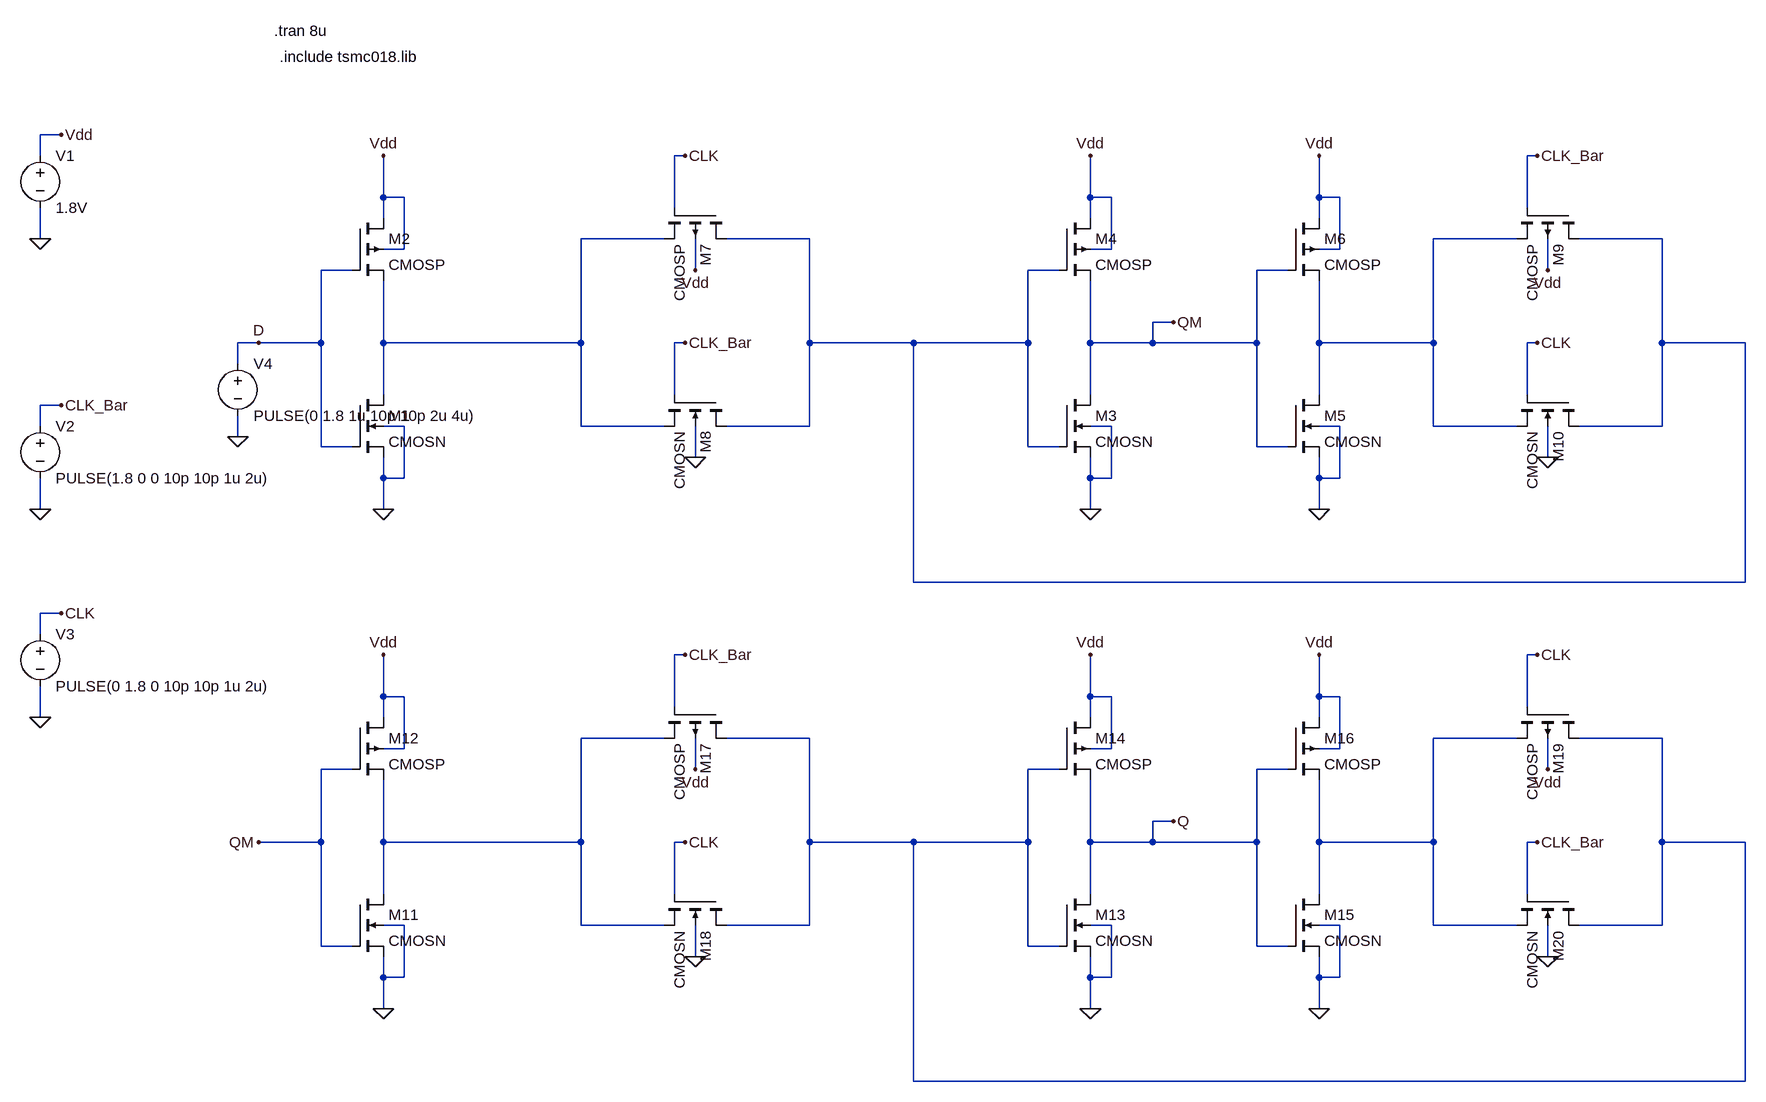
[diagram p0: schematic MasterSlaveD_FF.asc]
MasterSlaveD_FF.asc, the LTspice schematic file:
Version 4
SHEET 1 2900 1140
WIRE -320 -320 -352 -320
WIRE -352 -288 -352 -320
WIRE 640 -288 624 -288
WIRE 1952 -288 1936 -288
WIRE 176 -224 176 -288
WIRE 208 -224 176 -224
WIRE 1264 -224 1264 -288
WIRE 1296 -224 1264 -224
WIRE 1616 -224 1616 -288
WIRE 1648 -224 1616 -224
WIRE 624 -208 624 -288
WIRE 1936 -208 1936 -288
WIRE 176 -192 176 -224
WIRE 1264 -192 1264 -224
WIRE 1616 -192 1616 -224
WIRE -352 -160 -352 -208
WIRE 608 -160 480 -160
WIRE 832 -160 704 -160
WIRE 1920 -160 1792 -160
WIRE 2144 -160 2016 -160
WIRE 208 -144 208 -224
WIRE 208 -144 176 -144
WIRE 1296 -144 1296 -224
WIRE 1296 -144 1264 -144
WIRE 1648 -144 1648 -224
WIRE 1648 -144 1616 -144
WIRE 128 -112 80 -112
WIRE 656 -112 656 -160
WIRE 1216 -112 1168 -112
WIRE 1568 -112 1520 -112
WIRE 1968 -112 1968 -160
WIRE 1392 -32 1360 -32
WIRE -16 0 -48 0
WIRE 80 0 80 -112
WIRE 80 0 -16 0
WIRE 176 0 176 -96
WIRE 480 0 480 -160
WIRE 480 0 176 0
WIRE 640 0 624 0
WIRE 832 0 832 -160
WIRE 992 0 832 0
WIRE 1168 0 1168 -112
WIRE 1168 0 992 0
WIRE 1264 0 1264 -96
WIRE 1360 0 1360 -32
WIRE 1360 0 1264 0
WIRE 1520 0 1520 -112
WIRE 1520 0 1360 0
WIRE 1616 0 1616 -96
WIRE 1792 0 1792 -160
WIRE 1792 0 1616 0
WIRE 1952 0 1936 0
WIRE 2144 0 2144 -160
WIRE 2272 0 2144 0
WIRE -48 32 -48 0
WIRE 176 80 176 0
WIRE 624 80 624 0
WIRE 1264 80 1264 0
WIRE 1616 80 1616 0
WIRE 1936 80 1936 0
WIRE -320 96 -352 96
WIRE -352 128 -352 96
WIRE 208 128 176 128
WIRE 480 128 480 0
WIRE 608 128 480 128
WIRE 832 128 832 0
WIRE 832 128 704 128
WIRE 1296 128 1264 128
WIRE 1648 128 1616 128
WIRE 1792 128 1792 0
WIRE 1920 128 1792 128
WIRE 2144 128 2144 0
WIRE 2144 128 2016 128
WIRE -48 144 -48 112
WIRE 80 160 80 0
WIRE 128 160 80 160
WIRE 1168 160 1168 0
WIRE 1216 160 1168 160
WIRE 1520 160 1520 0
WIRE 1568 160 1520 160
WIRE 656 176 656 128
WIRE 1968 176 1968 128
WIRE 176 208 176 176
WIRE 208 208 208 128
WIRE 208 208 176 208
WIRE 1264 208 1264 176
WIRE 1296 208 1296 128
WIRE 1296 208 1264 208
WIRE 1616 208 1616 176
WIRE 1648 208 1648 128
WIRE 1648 208 1616 208
WIRE -352 256 -352 208
WIRE 176 256 176 208
WIRE 1264 256 1264 208
WIRE 1616 256 1616 208
WIRE 992 368 992 0
WIRE 2272 368 2272 0
WIRE 2272 368 992 368
WIRE -320 416 -352 416
WIRE -352 448 -352 416
WIRE 640 480 624 480
WIRE 1952 480 1936 480
WIRE 176 544 176 480
WIRE 208 544 176 544
WIRE 1264 544 1264 480
WIRE 1296 544 1264 544
WIRE 1616 544 1616 480
WIRE 1648 544 1616 544
WIRE 624 560 624 480
WIRE 1936 560 1936 480
WIRE -352 576 -352 528
WIRE 176 576 176 544
WIRE 1264 576 1264 544
WIRE 1616 576 1616 544
WIRE 608 608 480 608
WIRE 832 608 704 608
WIRE 1920 608 1792 608
WIRE 2144 608 2016 608
WIRE 208 624 208 544
WIRE 208 624 176 624
WIRE 1296 624 1296 544
WIRE 1296 624 1264 624
WIRE 1648 624 1648 544
WIRE 1648 624 1616 624
WIRE 128 656 80 656
WIRE 656 656 656 608
WIRE 1216 656 1168 656
WIRE 1568 656 1520 656
WIRE 1968 656 1968 608
WIRE 1392 736 1360 736
WIRE 80 768 80 656
WIRE 80 768 -16 768
WIRE 176 768 176 672
WIRE 480 768 480 608
WIRE 480 768 176 768
WIRE 640 768 624 768
WIRE 832 768 832 608
WIRE 992 768 832 768
WIRE 1168 768 1168 656
WIRE 1168 768 992 768
WIRE 1264 768 1264 672
WIRE 1360 768 1360 736
WIRE 1360 768 1264 768
WIRE 1520 768 1520 656
WIRE 1520 768 1360 768
WIRE 1616 768 1616 672
WIRE 1792 768 1792 608
WIRE 1792 768 1616 768
WIRE 1952 768 1936 768
WIRE 2144 768 2144 608
WIRE 2272 768 2144 768
WIRE 176 848 176 768
WIRE 624 848 624 768
WIRE 1264 848 1264 768
WIRE 1616 848 1616 768
WIRE 1936 848 1936 768
WIRE 208 896 176 896
WIRE 480 896 480 768
WIRE 608 896 480 896
WIRE 832 896 832 768
WIRE 832 896 704 896
WIRE 1296 896 1264 896
WIRE 1648 896 1616 896
WIRE 1792 896 1792 768
WIRE 1920 896 1792 896
WIRE 2144 896 2144 768
WIRE 2144 896 2016 896
WIRE 80 928 80 768
WIRE 128 928 80 928
WIRE 1168 928 1168 768
WIRE 1216 928 1168 928
WIRE 1520 928 1520 768
WIRE 1568 928 1520 928
WIRE 656 944 656 896
WIRE 1968 944 1968 896
WIRE 176 976 176 944
WIRE 208 976 208 896
WIRE 208 976 176 976
WIRE 1264 976 1264 944
WIRE 1296 976 1296 896
WIRE 1296 976 1264 976
WIRE 1616 976 1616 944
WIRE 1648 976 1648 896
WIRE 1648 976 1616 976
WIRE 176 1024 176 976
WIRE 1264 1024 1264 976
WIRE 1616 1024 1616 976
WIRE 992 1136 992 768
WIRE 2272 1136 2272 768
WIRE 2272 1136 992 1136
FLAG -16 0 D
FLAG 176 -288 Vdd
FLAG 656 -112 Vdd
FLAG 176 256 0
FLAG 656 176 0
FLAG 1264 256 0
FLAG 1616 256 0
FLAG 1264 -288 Vdd
FLAG 1616 -288 Vdd
FLAG 640 -288 CLK
FLAG 640 0 CLK_Bar
FLAG 1968 -112 Vdd
FLAG 1968 176 0
FLAG 1952 0 CLK
FLAG 1952 -288 CLK_Bar
FLAG 1392 -32 QM
FLAG -16 768 QM
FLAG 176 480 Vdd
FLAG 656 656 Vdd
FLAG 176 1024 0
FLAG 656 944 0
FLAG 1264 1024 0
FLAG 1616 1024 0
FLAG 1264 480 Vdd
FLAG 1616 480 Vdd
FLAG 640 768 CLK
FLAG 640 480 CLK_Bar
FLAG 1968 656 Vdd
FLAG 1968 944 0
FLAG 1952 480 CLK
FLAG 1952 768 CLK_Bar
FLAG 1392 736 Q
FLAG -352 -160 0
FLAG -352 256 0
FLAG -352 576 0
FLAG -320 -320 Vdd
FLAG -320 96 CLK_Bar
FLAG -320 416 CLK
FLAG -48 144 0
SYMBOL cmosn 128 80 R0
SYMATTR InstName M1
SYMATTR Value2 l=180n w=180n
SYMBOL cmosp 128 -192 R0
SYMATTR InstName M2
SYMATTR Value2 l=180n w=540n
SYMBOL cmosn 1216 80 R0
SYMATTR InstName M3
SYMATTR Value2 l=180n w=180n
SYMBOL cmosp 1216 -192 R0
SYMATTR InstName M4
SYMATTR Value2 l=180n w=540n
SYMBOL cmosn 1568 80 R0
SYMATTR InstName M5
SYMATTR Value2 l=180n w=180n
SYMBOL cmosp 1568 -192 R0
SYMATTR InstName M6
SYMATTR Value2 l=180n w=540n
SYMBOL cmosp 704 -208 R90
SYMATTR InstName M7
SYMATTR Value2 l=180n w=180n
SYMBOL cmosn 704 80 R90
SYMATTR InstName M8
SYMATTR Value2 l=180n w=180n
SYMBOL cmosp 2016 -208 R90
SYMATTR InstName M9
SYMATTR Value2 l=180n w=180n
SYMBOL cmosn 2016 80 R90
SYMATTR InstName M10
SYMATTR Value2 l=180n w=180n
SYMBOL cmosn 128 848 R0
SYMATTR InstName M11
SYMATTR Value2 l=180n w=180n
SYMBOL cmosp 128 576 R0
SYMATTR InstName M12
SYMATTR Value2 l=180n w=540n
SYMBOL cmosn 1216 848 R0
SYMATTR InstName M13
SYMATTR Value2 l=180n w=180n
SYMBOL cmosp 1216 576 R0
SYMATTR InstName M14
SYMATTR Value2 l=180n w=540n
SYMBOL cmosn 1568 848 R0
SYMATTR InstName M15
SYMATTR Value2 l=180n w=180n
SYMBOL cmosp 1568 576 R0
SYMATTR InstName M16
SYMATTR Value2 l=180n w=540n
SYMBOL cmosp 704 560 R90
SYMATTR InstName M17
SYMATTR Value2 l=180n w=180n
SYMBOL cmosn 704 848 R90
SYMATTR InstName M18
SYMATTR Value2 l=180n w=180n
SYMBOL cmosp 2016 560 R90
SYMATTR InstName M19
SYMATTR Value2 l=180n w=180n
SYMBOL cmosn 2016 848 R90
SYMATTR InstName M20
SYMATTR Value2 l=180n w=180n
SYMBOL voltage -352 -304 R0
WINDOW 123 0 0 Left 0
WINDOW 39 0 0 Left 0
SYMATTR InstName V1
SYMATTR Value 1.8V
SYMBOL voltage -352 112 R0
WINDOW 123 0 0 Left 0
WINDOW 39 0 0 Left 0
SYMATTR InstName V2
SYMATTR Value PULSE(1.8 0 0 10p 10p 1u 2u)
SYMBOL voltage -352 432 R0
WINDOW 123 0 0 Left 0
WINDOW 39 0 0 Left 0
SYMATTR InstName V3
SYMATTR Value PULSE(0 1.8 0 10p 10p 1u 2u)
SYMBOL voltage -48 16 R0
WINDOW 123 0 0 Left 0
WINDOW 39 0 0 Left 0
SYMATTR InstName V4
SYMATTR Value PULSE(0 1.8 1u 10p 10p 2u 4u)
TEXT 8 -480 Left 2 !.tran 8u
TEXT 16 -440 Left 2 !.include tsmc018.lib

The netlist it stands for:
* MasterSlaveD_FF.asc
M1 N001 D 0 0 CMOSN l=180n w=180n
M2 Vdd D N001 Vdd CMOSP l=180n w=540n
M3 QM N002 0 0 CMOSN l=180n w=180n
M4 Vdd N002 QM Vdd CMOSP l=180n w=540n
M5 N003 QM 0 0 CMOSN l=180n w=180n
M6 Vdd QM N003 Vdd CMOSP l=180n w=540n
M7 N002 CLK N001 Vdd CMOSP l=180n w=180n
M8 N002 CLK_Bar N001 0 CMOSN l=180n w=180n
M9 N002 CLK_Bar N003 Vdd CMOSP l=180n w=180n
M10 N002 CLK N003 0 CMOSN l=180n w=180n
M11 N004 QM 0 0 CMOSN l=180n w=180n
M12 Vdd QM N004 Vdd CMOSP l=180n w=540n
M13 Q N005 0 0 CMOSN l=180n w=180n
M14 Vdd N005 Q Vdd CMOSP l=180n w=540n
M15 N006 Q 0 0 CMOSN l=180n w=180n
M16 Vdd Q N006 Vdd CMOSP l=180n w=540n
M17 N005 CLK_Bar N004 Vdd CMOSP l=180n w=180n
M18 N005 CLK N004 0 CMOSN l=180n w=180n
M19 N005 CLK N006 Vdd CMOSP l=180n w=180n
M20 N005 CLK_Bar N006 0 CMOSN l=180n w=180n
V1 Vdd 0 1.8V
V2 CLK_Bar 0 PULSE(1.8 0 0 10p 10p 1u 2u)
V3 CLK 0 PULSE(0 1.8 0 10p 10p 1u 2u)
V4 D 0 PULSE(0 1.8 1u 10p 10p 2u 4u)
.model NMOS NMOS
.model PMOS PMOS
.lib standard.mos
.tran 8u
.include tsmc018.lib
.backanno
.end